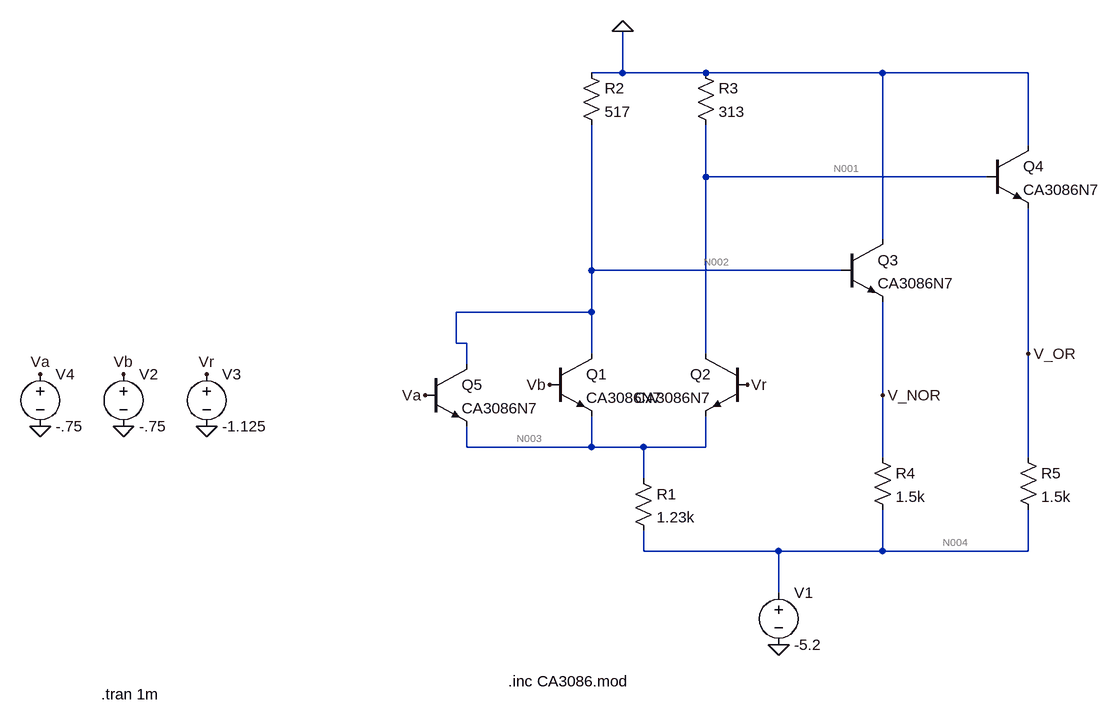
[diagram p0: schematic lab7.asc]
lab7.asc, the LTspice schematic file:
Version 4
SHEET 1 932 680
WIRE 176 -320 176 -384
WIRE 176 -320 128 -320
WIRE 304 -320 176 -320
WIRE 576 -320 304 -320
WIRE 800 -320 576 -320
WIRE 800 -208 800 -320
WIRE 304 -160 304 -240
WIRE 736 -160 304 -160
WIRE 576 -64 576 -320
WIRE 128 -16 128 -240
WIRE 512 -16 128 -16
WIRE 128 48 128 -16
WIRE 128 48 -80 48
WIRE -80 96 -80 48
WIRE -64 96 -80 96
WIRE 128 112 128 48
WIRE 304 112 304 -160
WIRE 800 112 800 -112
WIRE -64 128 -64 96
WIRE 576 176 576 32
WIRE -64 256 -64 224
WIRE 128 256 128 208
WIRE 128 256 -64 256
WIRE 208 256 128 256
WIRE 304 256 304 208
WIRE 304 256 208 256
WIRE 576 272 576 176
WIRE 800 272 800 112
WIRE 208 304 208 256
WIRE 208 416 208 384
WIRE 416 416 208 416
WIRE 576 416 576 352
WIRE 576 416 416 416
WIRE 800 416 800 352
WIRE 800 416 576 416
WIRE 416 480 416 416
FLAG 176 -384 0
FLAG 416 560 0
FLAG 64 160 Vb
FLAG 368 160 Vr
FLAG 576 176 V_NOR
FLAG 800 112 V_OR
FLAG -592 224 0
FLAG -592 144 Vb
FLAG -464 224 0
FLAG -464 144 Vr
FLAG -128 176 Va
FLAG -720 224 0
FLAG -720 144 Va
SYMBOL npn 64 112 R0
SYMATTR InstName Q1
SYMATTR Value CA3086N7
SYMBOL npn 368 112 M0
SYMATTR InstName Q2
SYMATTR Value CA3086N7
SYMBOL npn 512 -64 R0
SYMATTR InstName Q3
SYMATTR Value CA3086N7
SYMBOL npn 736 -208 R0
SYMATTR InstName Q4
SYMATTR Value CA3086N7
SYMBOL res 192 288 R0
SYMATTR InstName R1
SYMATTR Value 1.23k
SYMBOL res 112 -336 R0
SYMATTR InstName R2
SYMATTR Value 517
SYMBOL res 288 -336 R0
SYMATTR InstName R3
SYMATTR Value 313
SYMBOL res 560 256 R0
SYMATTR InstName R4
SYMATTR Value 1.5k
SYMBOL res 784 256 R0
SYMATTR InstName R5
SYMATTR Value 1.5k
SYMBOL voltage 416 464 R0
WINDOW 123 0 0 Left 2
WINDOW 39 0 0 Left 2
SYMATTR InstName V1
SYMATTR Value -5.2
SYMBOL voltage -592 128 R0
WINDOW 123 0 0 Left 2
WINDOW 39 0 0 Left 2
SYMATTR InstName V2
SYMATTR Value -.75
SYMBOL voltage -464 128 R0
WINDOW 123 0 0 Left 2
WINDOW 39 0 0 Left 2
SYMATTR InstName V3
SYMATTR Value -1.125
SYMBOL npn -128 128 R0
SYMATTR InstName Q5
SYMATTR Value CA3086N7
SYMBOL voltage -720 128 R0
WINDOW 123 0 0 Left 2
WINDOW 39 0 0 Left 2
SYMATTR InstName V4
SYMATTR Value -.75
TEXT 0 616 Left 2 !.inc CA3086.mod
TEXT -626 636 Left 2 !.tran 1m

The netlist it stands for:
* lab7.asc
Q1 N002 Vb N003 0 CA3086N7
Q2 N001 Vr N003 0 CA3086N7
Q3 0 N002 V_NOR 0 CA3086N7
Q4 0 N001 V_OR 0 CA3086N7
R1 N003 N004 1.23k
R2 0 N002 517
R3 0 N001 313
R4 V_NOR N004 1.5k
R5 V_OR N004 1.5k
V1 N004 0 -5.2
V2 Vb 0 -.75
V3 Vr 0 -1.125
Q5 N002 Va N003 0 CA3086N7
V4 Va 0 -.75
.model NPN NPN
.model PNP PNP
.lib standard.bjt
.inc CA3086.mod
.tran 1m
.backanno
.end

* Results of the author's LTspice run, read from the files saved beside the schematic
* Operating Point, zero values left out:
*   V(n002) = -1.458 V
*   V(vb) = -750 mV
*   V(n003) = -1.536 V
*   V(n001) = -5.884 mV
*   V(vr) = -1.125 V
*   V(v_nor) = -2.249 V
*   V(v_or) = -807.9 mV
*   V(n004) = -5.2 V
*   V(va) = -750 mV
*   Ic(Q5) = 1.403 mA
*   Ib(Q5) = 86.03 µA
*   Ie(Q5) = -1.489 mA
*   Ic(Q4) = 2.909 mA
*   Ib(Q4) = 18.8 µA
*   Ie(Q4) = -2.928 mA
*   Ic(Q3) = 1.955 mA
*   Ib(Q3) = 12.45 µA
*   Ie(Q3) = -1.967 mA
*   Ic(Q2) = 803.7 pA
*   Ib(Q2) = 4.401 pA
*   Ie(Q2) = -808.1 pA
*   Ic(Q1) = 1.403 mA
*   Ib(Q1) = 86.03 µA
*   Ie(Q1) = -1.489 mA
*   I(R5) = 2.928 mA
*   I(R4) = 1.967 mA
*   I(R3) = 18.8 µA
*   I(R2) = 2.819 mA
*   I(R1) = 2.979 mA
*   I(V4) = -86.03 µA
*   I(V3) = -4.401 pA
*   I(V2) = -86.03 µA
*   I(V1) = 7.874 mA
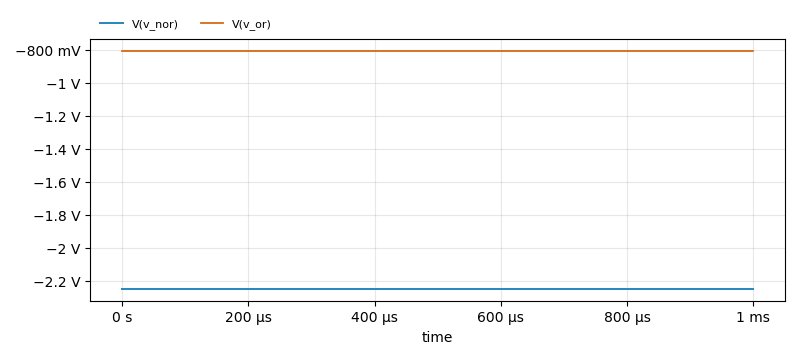
[diagram p1: Transient Analysis of lab7.asc, plotted from the saved traces]
* Transient Analysis, 1 run:
*   V(v_nor): min -2.249 V, max -2.249 V, average -2.249 V, rms 2.249 V, last -2.249 V
*   V(v_or): min -807.9 mV, max -807.9 mV, average -807.9 mV, rms 807.9 mV, last -807.9 mV